# EAGLE design tmod-edison (EAGLE 7.7.0)
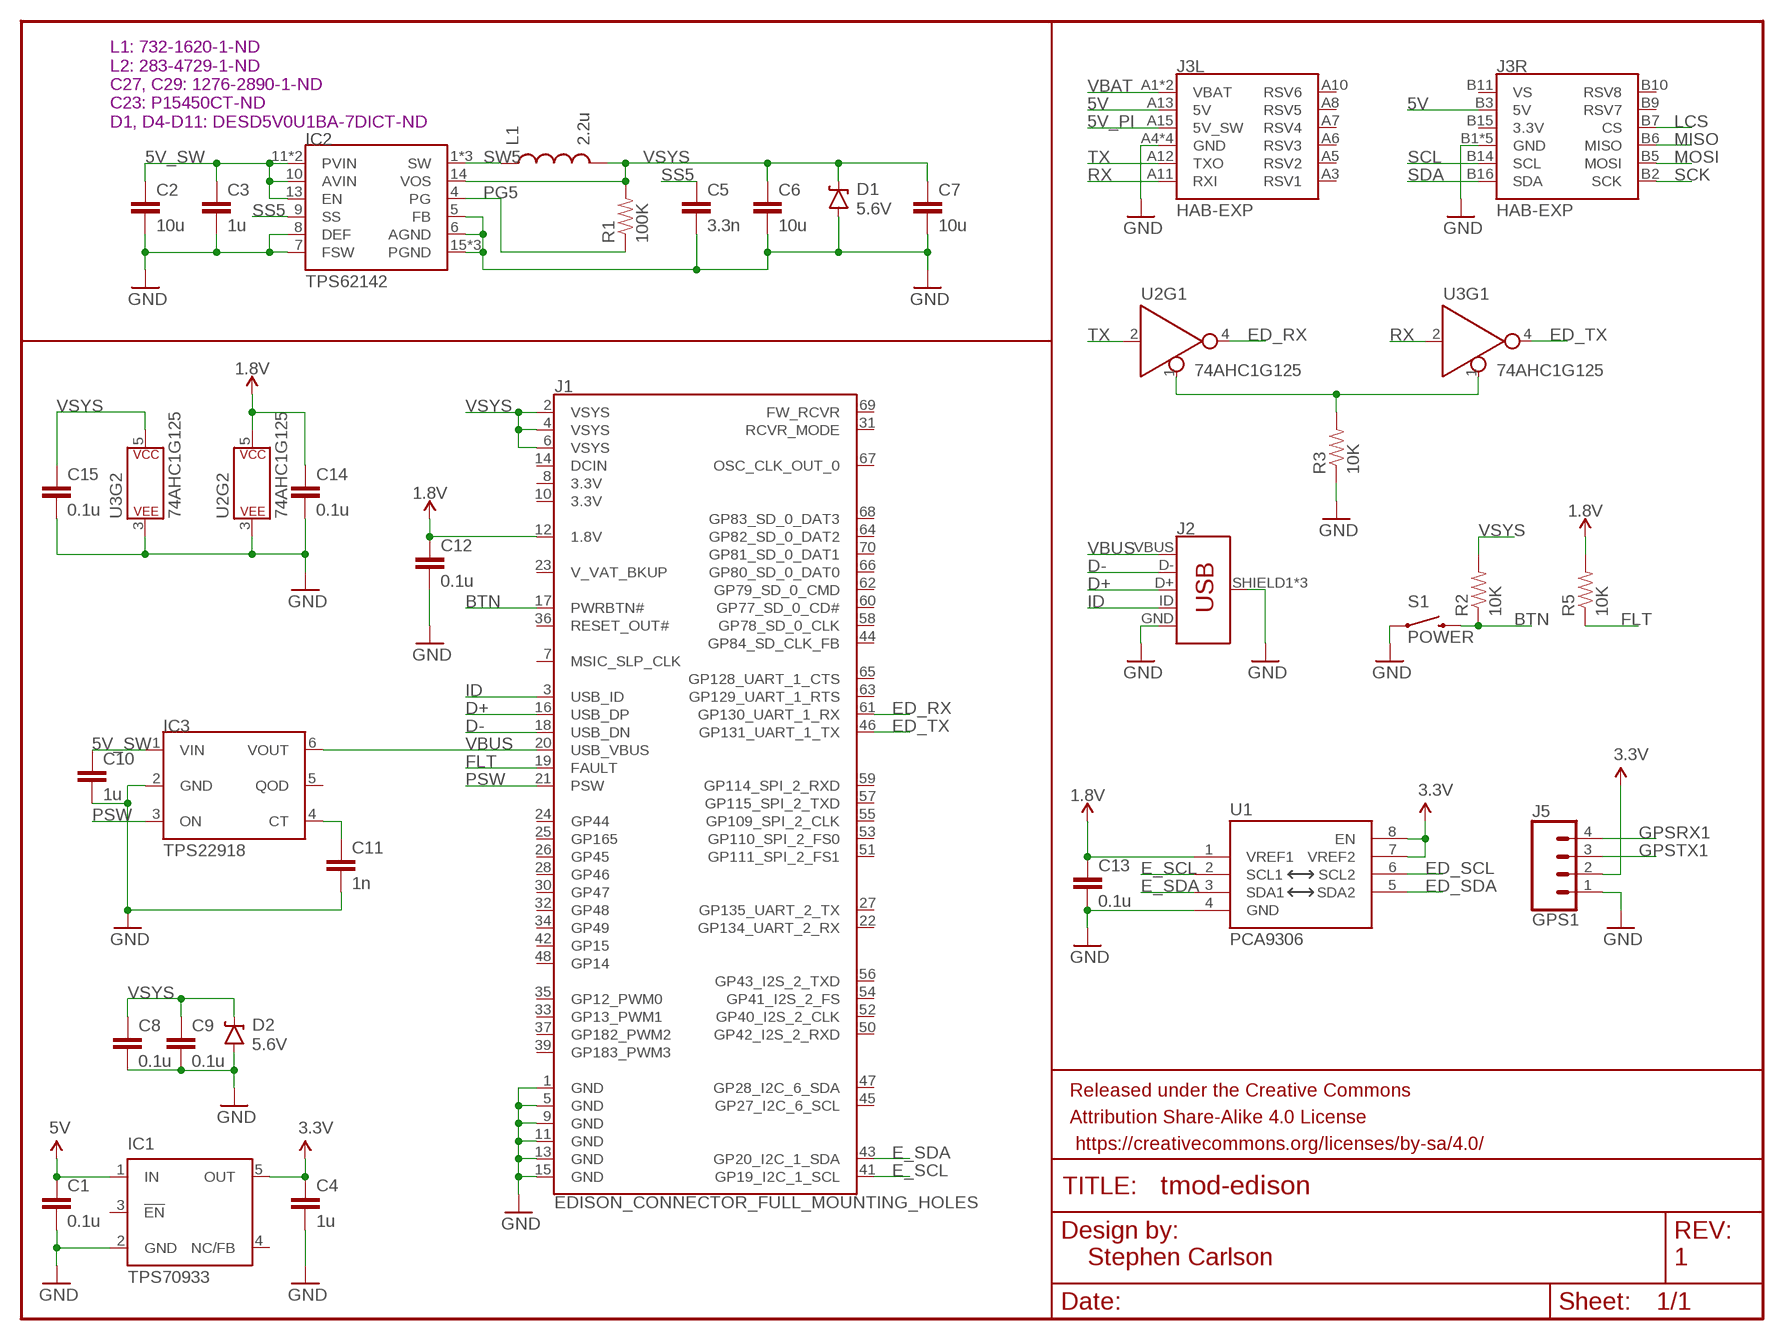
[diagram p0: schematic, sheet 1]

## Parts
C1  0.1u  CAP0805  [0805]
C2  10u  CAP0805  [0805]
C3  1u  CAP0805  [0805]
C4  1u  CAP0805  [0805]
C5  3.3n  CAP0805  [0805]
C6  10u  CAP0805  [0805]
C7  10u  CAP0805  [0805]
C8  0.1u  CAP0805  [0805]
C9  0.1u  CAP0805  [0805]
C10  1u  CAP0805  [0805]
C11  1n  CAP0805  [0805]
C12  0.1u  CAP0805  [0805]
C13  0.1u  CAP0805  [0805]
C14  0.1u  CAP0805  [0805]
C15  0.1u  CAP0805  [0805]
D1  5.6V  DIODE-ZENER5.6V  [SOD-323]
D2  5.6V  DIODE-ZENER5.6V  [SOD-323]
FRAME1  FRAME-LETTERNO_PACKAGE  [DUMMY]
IC1  TPS70933  TPS77033  [SOT23-DBV]
IC2  TPS62142  TPS62140  [QFN16-3X3MM]
IC3  TPS22918  [SOT23-6L]
J1  EDISON_CONNECTOR_FULL_MOUNTING_HOLES  [EDISON_DAUGHTER]
J2  USB_MICRO-B_FEMALE-SMT  [USB-B-MICRO-SMD]
J3  HAB-EXP  [HAB-EXP]
J5  GPS1  CONN_04JST-PTH  [JST-4-PTH]
L1  2.2u  INDUCTORMPIA4012V2  [MPIA4012V2]
R1  100K  RESISTOR0805-RES  [0805]
R2  10K  RESISTOR0805-RES  [0805]
R3  10K  RESISTOR0805-RES  [0805]
R5  10K  RESISTOR0805-RES  [0805]
S1  POWER  SWITCH  [TACTILE-PTH-THIN]
U1  PCA9306  PCA9306PCA9306DC-1:1  [PCA9306DC]
U2  74AHC1G125  74AHC1G125D  [SOT23-5]
U3  74AHC1G125  74AHC1G125D  [SOT23-5]

## Nets
1.8V: C12.1 C13.1 C14.1 J1.12(1.8V) R5.2 U1.1(VREF1) U2.5(P$V+)
3.3V: C4.1 IC1.5(OUT) J5.2 U1.7(VREF2) U1.8(EN)
5V: C1.1 IC1.1(IN) J3.A13(L:5V) J3.B3(R:5V)
5V_PI: J3.A15(L:5V_SW)
5V_SW: C2.1 C3.1 C10.1 IC2.10(AVIN) IC2.11(PVIN) IC2.12(PVIN) IC2.13(EN) IC3.1(VIN)
BTN: J1.17(PWRBTN#) R2.1 S1.2
CT: C11.1 IC3.4(CT)
D+: J1.16(USB_DP) J2.D+
D-: J1.18(USB_DN) J2.D-
E_SCL: J1.41(GP19_I2C_1_SCL) U1.2(SCL1)
E_SDA: J1.43(GP20_I2C_1_SDA) U1.3(SDA1)
ED_RX: J1.61(GP130_UART_1_RX) U2.4(Y)
ED_SCL: U1.6(SCL2)
ED_SDA: U1.5(SDA2)
ED_TX: J1.46(GP131_UART_1_TX) U3.4(Y)
FLT: J1.19(FAULT) R5.1
GND: C1.2 C2.2 C3.2 C4.2 C5.2 C6.2 C7.2 C8.2 C9.2 C10.2 C11.2 C12.2 C13.2 C14.2 C15.2 D1.A D2.A IC1.2(GND) IC2.5(FB) IC2.6(AGND) IC2.7(FSW) IC2.8(DEF) IC2.15(PGND) IC2.16(PGND) IC2.EXT(PGND) IC3.2(GND) J1.1(GND) J1.5(GND) J1.9(GND) J1.11(GND) J1.13(GND) J1.15(GND) J2.GND J2.SHIELD1(SHIELD) J2.SHIELD2(SHIELD) J2.SHIELD3(SHIELD) J3.A4(L:GND) J3.A9(L:GND) J3.A14(L:GND) J3.A16(L:GND) J3.B1(R:GND) J3.B4(R:GND) J3.B8(R:GND) J3.B12(R:GND) J3.B13(R:GND) J5.1 R3.1 S1.1 U1.4(GND) U2.3(P$V-) U3.3(P$V-)
GPSRX1: J5.4
GPSTX1: J5.3
ID: J1.3(USB_ID) J2.ID
LCS: J3.B7(R:CS)
MISO: J3.B6(R:MISO)
MOSI: J3.B5(R:MOSI)
PG5: IC2.4(PG) R1.1
PSW: IC3.3(ON) J1.21(PSW)
RX: J3.A11(L:RXI) U3.2(A)
SCK: J3.B2(R:SCK)
SCL: J3.B14(R:SCL)
SDA: J3.B16(R:SDA)
SS5: C5.1 IC2.9(SS)
SW5: IC2.1(SW) IC2.2(SW) IC2.3(SW) L1.1
TX: J3.A12(L:TXO) U2.2(A)
UART_EN: R3.2 U2.1(!EN) U3.1(!EN)
VBAT: J3.A1(L:VBAT) J3.A2(L:VBAT)
VBUS: IC3.6(VOUT) J1.20(USB_VBUS) J2.VBUS
VSYS: C6.1 C7.1 C8.1 C9.1 C15.1 D1.C D2.C IC2.14(VOS) J1.2(VSYS) J1.4(VSYS) J1.6(VSYS) L1.2 R1.2 R2.2 U3.5(P$V+)
Unconnected: IC1.3(!EN) IC1.4(NC/FB) IC3.5(QOD) J1.7(MSIC_SLP_CLK) J1.8(3.3V) J1.10(3.3V) J1.14(DCIN) J1.22(GP134_UART_2_RX) J1.23(V_VAT_BKUP) J1.24(GP44) J1.25(GP165) J1.26(GP45) J1.27(GP135_UART_2_TX) J1.28(GP46) J1.30(GP47) J1.31(RCVR_MODE) J1.32(GP48) J1.33(GP13_PWM1) J1.34(GP49) J1.35(GP12_PWM0) J1.36(RESET_OUT#) J1.37(GP182_PWM2) J1.39(GP183_PWM3) J1.42(GP15) J1.44(GP84_SD_CLK_FB) J1.45(GP27_I2C_6_SCL) J1.47(GP28_I2C_6_SDA) J1.48(GP14) J1.50(GP42_I2S_2_RXD) J1.51(GP111_SPI_2_FS1) J1.52(GP40_I2S_2_CLK) J1.53(GP110_SPI_2_FS0) J1.54(GP41_I2S_2_FS) J1.55(GP109_SPI_2_CLK) J1.56(GP43_I2S_2_TXD) J1.57(GP115_SPI_2_TXD) J1.58(GP78_SD_0_CLK) J1.59(GP114_SPI_2_RXD) J1.60(GP77_SD_0_CD#) J1.62(GP79_SD_0_CMD) J1.63(GP129_UART_1_RTS) J1.64(GP82_SD_0_DAT2) J1.65(GP128_UART_1_CTS) J1.66(GP80_SD_0_DAT0) J1.67(OSC_CLK_OUT_0) J1.68(GP83_SD_0_DAT3) J1.69(FW_RCVR) J1.70(GP81_SD_0_DAT1) J3.A3(L:RSV1) J3.A5(L:RSV2) J3.A6(L:RSV3) J3.A7(L:RSV4) J3.A8(L:RSV5) J3.A10(L:RSV6) J3.B9(R:RSV7) J3.B10(R:RSV8)

## Notes on the sheet
- L1: 732-1620-1-ND
  L2: 283-4729-1-ND
  C27, C29: 1276-2890-1-ND
  C23: P15450CT-ND
  D1, D4-D11: DESD5V0U1BA-7DICT-ND
- Stephen Carlson | 1

## Power pins joined to a net without a drawn wire
3.3V: J3.B15(R:3.3V)
VS: J3.B11(R:VS)

## Library data of the parts
C1-C15 = SparkFun-Passives:CAP: Capacitor Standard 0603 ceramic capacitor, and 0.1" leaded capacitor.
D1 D2 = SparkFun-DiscreteSemi:DIODE-ZENER: Zener Diode Production Part - 8199 3.4V Zener Voltage; PROD_ID: DIO-12442
FRAME1 = SparkFun-Aesthetics:FRAME-LETTER: Schematic Frame - Letter Standard 8.5x11 US Letter frame; DESIGNER: Nobody; VERSION: v01
IC1 = texas:TPS770*: ULTRALOW-POWER 50-mA LOW-DROPOUT LINEAR REGULATORS 50-mA Low-Dropout Regulator Source: http://focus.ti.com/lit/ds/symlink/tps77001.pdf; MF: TEXAS INSTRUMENTS; MPN: TPS77033DBVT; OC_FARNELL: 8461570; OC_NEWARK: 77C1187
IC2 = HAB:TPS62140: TPS62140/1/2/3 Adjustable or fixed output switch-mode 2A D-CAP2 regulator
IC3 = HAB:TPS22918: TPS22918 5.5-V, 2-A, 52-mΩOn-Resistance Load Switch
J1 = SparkFun-Connectors:EDISON_CONNECTOR_FULL: Intel ® Edison Hirose Connectors DF40 Series 70 pin connector 3mm headers and sockets used on the SparkFun Edison Blocks. Edison Daughter package includes layout for the Edison module itself, including mounting holes and antenna area marked. SparkFun Products: SparkFun ADC Edison Block <https://www.sparkfun.com/products/13770> SparkFun Power Edison Block <https://www.sparkfun.com/products/13727> SparkFun Base Edison Block <https://www.sparkfun.com/products/13045> SparkFun Dual H-Bridge Edison Block <https://www.sparkfun.com/products/13043> SparkFun microSD Edison Block <https://www.sparkfun.com/products/13041>
J2 = SparkFun-Connectors:USB_MICRO-B: USB Type Micro-B Connector Male/female and PTH/SMT variants SparkFun Products: SparkFun microB USB Breakout <https://www.sparkfun.com/products/12035> SparkFun USB microB Plug Breakout <https://www.sparkfun.com/products/10031> SparkFun ESP8266 Thing <https://www.sparkfun.com/products/13231>; PROD_ID: CONN-11752
J3 = HAB:HAB-EXP: HAB Expansion Connector Dual 2x8 expansion connectors for HAB project
J5 = SparkFun-Connectors:CONN_04: Multi connection point. Often used as Generic Header-pin footprint for 0.1 inch spaced/style header connections On any of the 0.1 inch spaced packages, you can populate with these: Break Away Headers - Straight <https://www.sparkfun.com/products/116> (PRT-00116) Break Away Male Headers - Right Angle <https://www.sparkfun.com/products/553> (PRT-00553) Female Headers <https://www.sparkfun.com/products/115> (PRT-00115) Break Away Headers - Machine Pin <https://www.sparkfun.com/products/117> (PRT-00117) Break Away Female Headers - Swiss Machine Pin <https://www.sparkfun.com/products/743> (PRT-00743) For SCREWTERMINALS and SPRING TERMINALS visit here: Screw Terimnals on SparkFun.com <https://www.sparkfun.com/search/results?term=Screw+Terminals> (5mm/3.5mm/2.54mm spacing) This device is also useful as a general connection point to wire up your design to another part of your project. Our various solder wires solder well into these plated through hole pads. Hook-Up Wire - Assortment (Stranded, 22 AWG) <https://www.sparkfun.com/products/11375> (PRT-11375) Hook-Up Wire - Assortment (Solid Core, 22 AWG) <https://www.sparkfun.com/products/11367> (PRT-11367) View the entire wire category on our website here <https://www.sparkfun.com/categories/141> Special notes: Molex polarized connector foot print use with SKU : PRT-08231 with associated crimp pins and housings. 1MM SMD Version SKU: PRT-10208; PROD_ID: WIRE-13531; SF_ID: PRT-09916
L1 = HAB:INDUCTOR: INDUCTOR Standard inductor, with some new packages Why do inductors never come in standard packages!?
R1-R3 R5 = SparkFun-Passives:RESISTOR: Resistor Basic schematic elements and footprints for 0603, 1206, and PTH resistors.
S1 = HAB:SWITCH: SWITCH Package for the MJTP1250, a thinner and lighter PTH push button switch.
U1 = SparkFun-IC-Comms:PCA9306: Bidirectional I2C level shifter Not compatible with all available part number pinout schemes- DOUBLE CHECK!!! Datasheet <https://cdn.sparkfun.com/datasheets/BreakoutBoards/PCA9306DC.pdf> SparkFun Products SparkFun Inventor's Kit for RedBot <https://www.sparkfun.com/products/12649> (ROB-12649) SparkFun RedBot Basic Kit <https://www.sparkfun.com/products/13166> (ROB-13166) SparkFun Level Translator Breakout - PCA9306 <https://www.sparkfun.com/products/11955> (BOB-11955) SparkFun Block for Intel Edison - ADC <https://www.sparkfun.com/products/13770> (DEV-13770) SparkFun Block for Intel® Edison - Raspberry Pi B <https://www.sparkfun.com/products/13044> (DEV-13044) SparkFun RedBot Sensor - Accelerometer <https://www.sparkfun.com/products/12589> (SEN-12589); PROD_ID: IC-10023
U2 U3 = SparkFun-IC-Logic:74*1G125: Single buffer Buffers & Line Drivers Tri-State Single Bus SOT-23-5 Datasheet SparkFun Products SparkFun SAMD21 Mini Breakout <https://www.sparkfun.com/products/13664> (DEV-13664) SparkFun SAMD21 Dev Breakout <https://www.sparkfun.com/products/13672> (DEV-13672) SparkFun MIDI Shield <https://www.sparkfun.com/products/12898> (DEV-12898) SparkFun WiFi Shield - CC3000 <https://www.sparkfun.com/products/12071> (DEV-12071); PROD_ID: IC-11920; VALUE: SN74AHC1G125

## Board
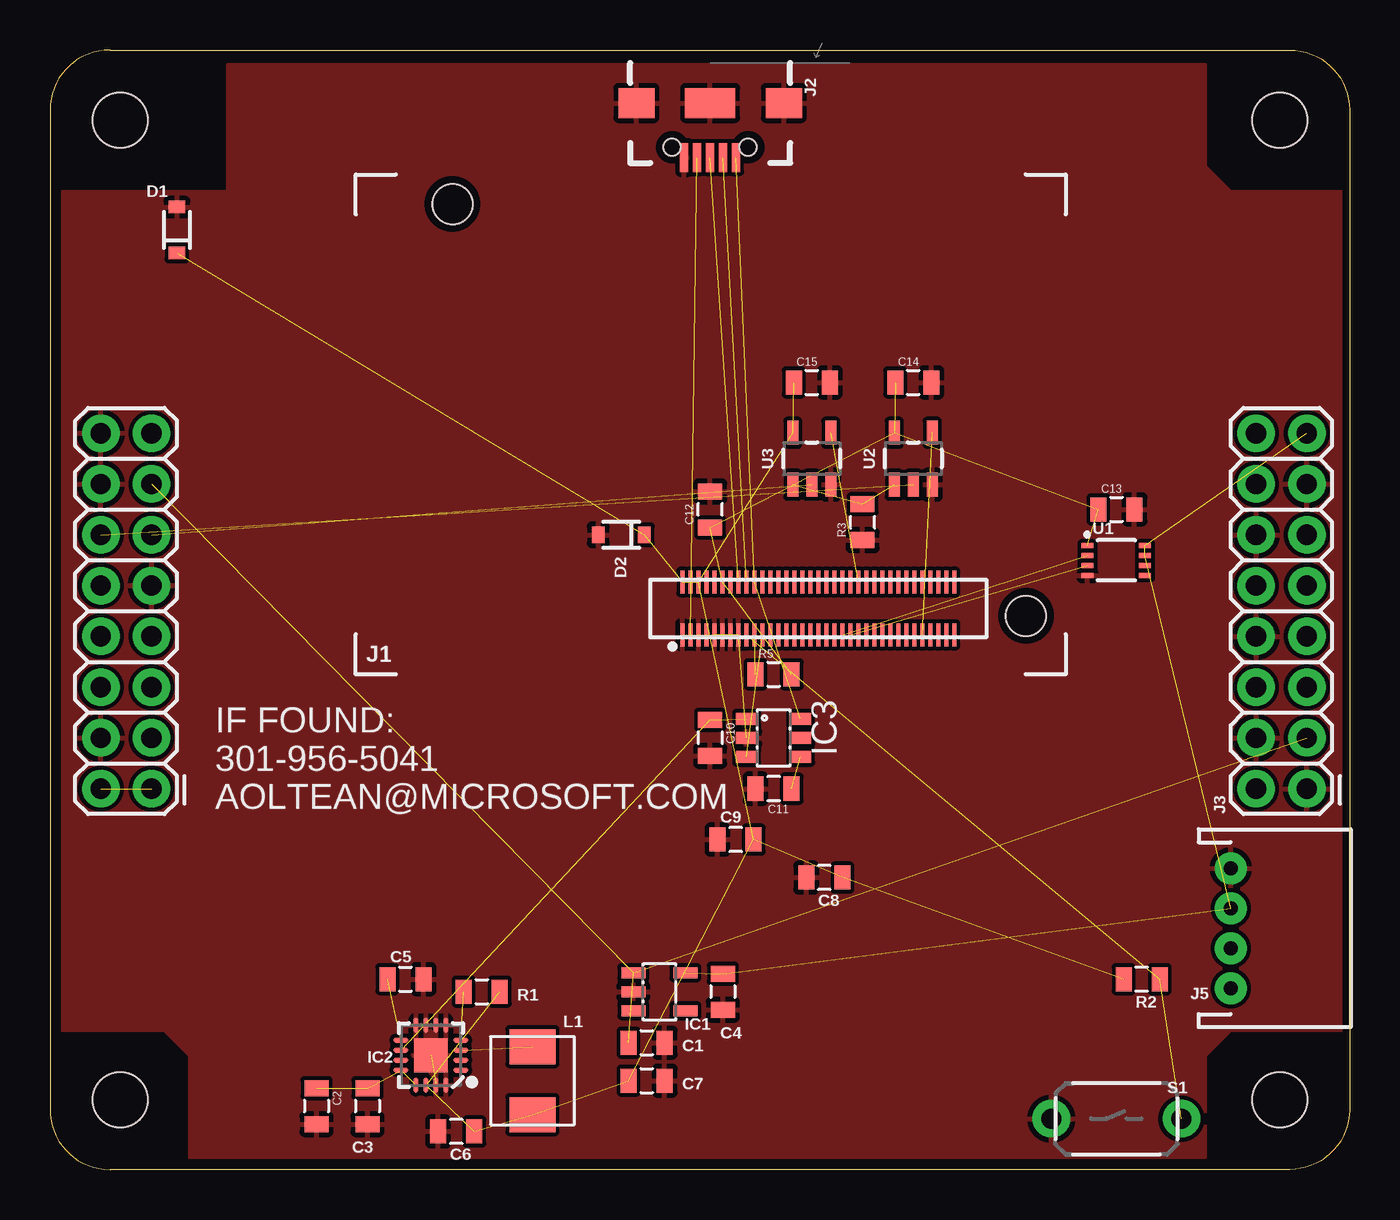
[diagram p1: board, top side]
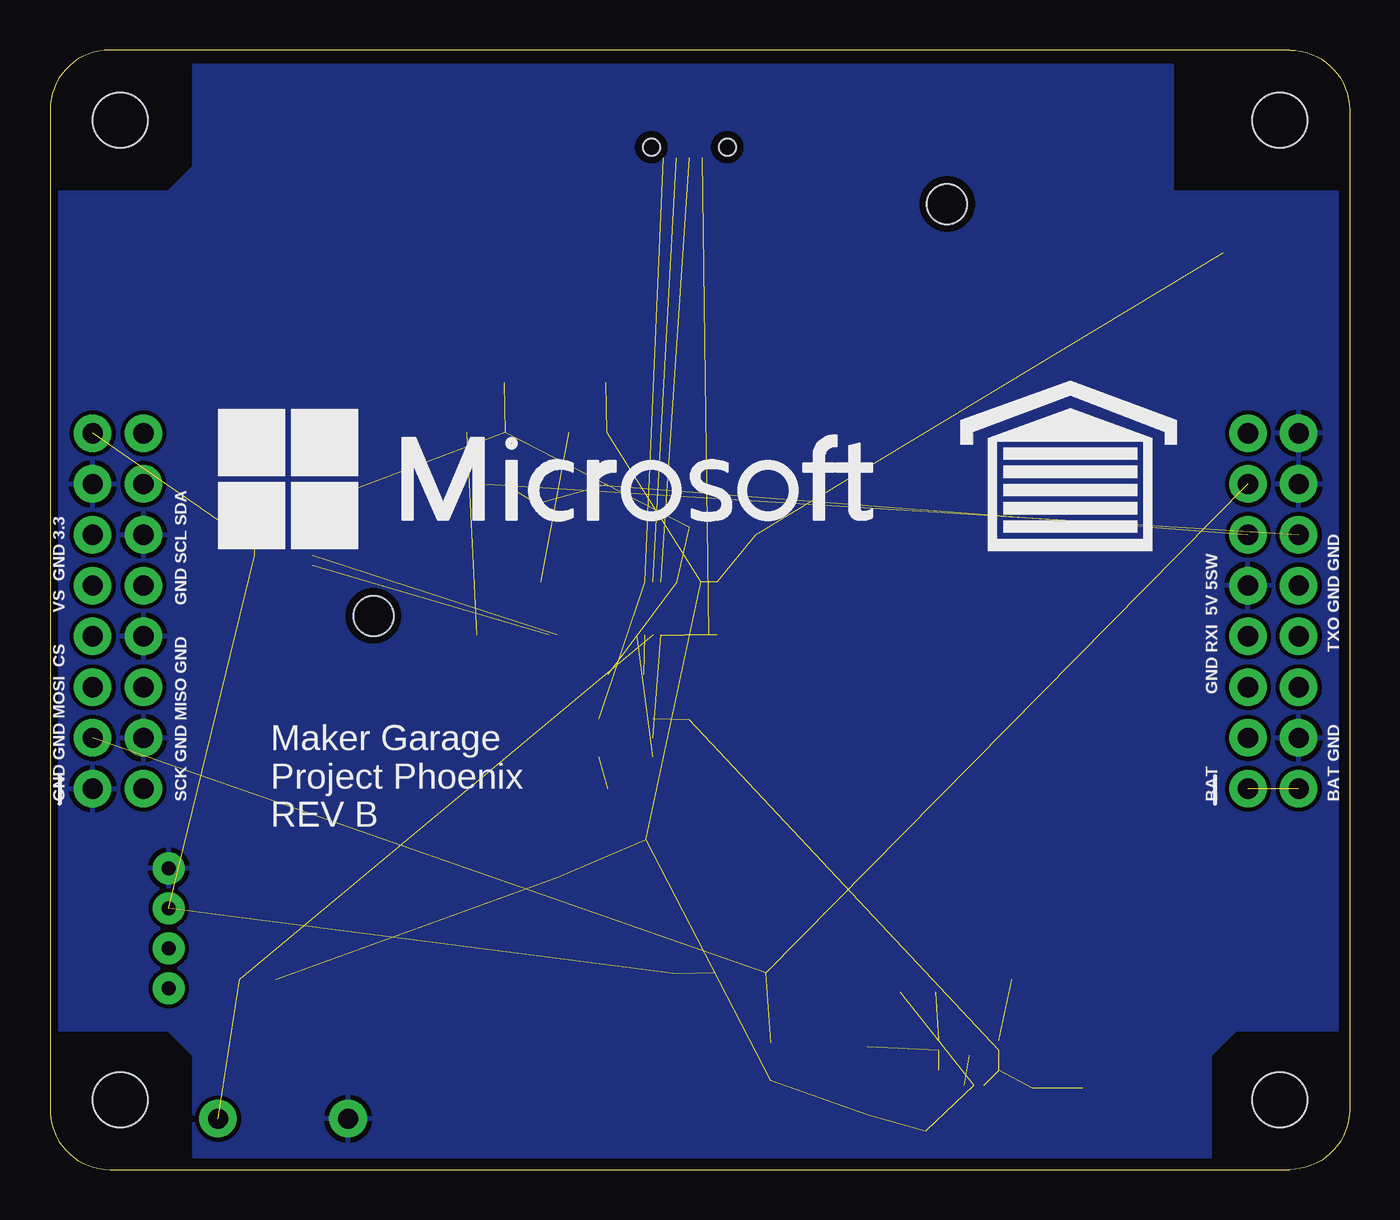
[diagram p2: board, bottom side, seen from below]

Size 65 x 56 mm. Coordinates in mm from the lower left corner, seen from the top.
Outline: 0,53 0,3 arc90 3,0 62,0 arc90 65,3 65,53 arc90 62,56 3,56 arc90 0,53
Copper layers (1*16): Top 0.035559375mm / dielectric 1.6mm / Bottom 0.035559375mm
Design rules "oshpark-2layer *": minimum track width 6mil, minimum drill 10mil, track to track 6mil, track to pad 6mil, pad to pad 6mil, via to via 6mil, smd to smd 6mil, copper to edge 15mil, drill to drill 6mil, minimum pad ring 5mil, minimum via ring 5mil, stop-mask expansion 2.5mil, vias tented up to drill 0mil, thermal gap 10mil
Holes 2.75 mm at 3.5,52.5 61.5,3.5 3.5,3.5 61.5,52.5
tKeepout: area 0.5,49.5 to 6.5,55.5; area 0.5,0.5 to 6.5,6.5; area 58.5,0.5 to 64.5,6.5; area 58.5,49.5 to 64.5,55.5

### Footprints (pad centres in the part's own frame; a part is rotated, then mirrored left to right if it is on the bottom)
0805 = smd 0.8 x 1.2: 1 -0.9,0; 2 0.9,0
SOD-323 = smd 0.63 x 0.83: A 1.15,0; C -1.15,0
SOT23-DBV = smd 0.55 x 1.2: 1 -0.95,-1.3; 2 0,-1.3; 3 0.95,-1.3; 4 0.95,1.3; 5 -0.95,1.3
QFN16-3X3MM = smd 0.75 x 0.25: 1 -1.5,0.75; 2 -1.5,0.25; 3 -1.5,-0.25; 4 -1.5,-0.75; 9 1.5,-0.75; 10 1.5,-0.25; 11 1.5,0.25; 12 1.5,0.75 | smd 0.25 x 0.75: 5 -0.75,-1.5; 6 -0.25,-1.5; 7 0.25,-1.5; 8 0.75,-1.5; 13 0.75,1.5; 14 0.25,1.5; 15 -0.25,1.5; 16 -0.75,1.5 | smd 1.68 x 1.68: EXT 0,0
SOT23-6L = smd 0.6 x 1.05: 1 -0.95,-1.35; 2 0,-1.35; 3 0.95,-1.35; 4 0.95,1.35; 5 0,1.35; 6 -0.95,1.35
EDISON_DAUGHTER = smd 1.14 x 0.2: 1 1.98,19.17; 2 4.62,19.17; 3 1.98,18.77; 4 4.62,18.77; 5 1.98,18.37; 6 4.62,18.37; 7 1.98,17.97; 8 4.62,17.97; 9 1.98,17.57; 10 4.62,17.57; 11 1.98,17.17; 12 4.62,17.17; 13 1.98,16.77; 14 4.62,16.77; 15 1.98,16.37; 16 4.62,16.37; 17 1.98,15.97; 18 4.62,15.97; 19 1.98,15.57; 20 4.62,15.57; 21 1.98,15.17; 22 4.62,15.17; 23 1.98,14.77; 24 4.62,14.77; 25 1.98,14.37; 26 4.62,14.37; 27 1.98,13.97; 28 4.62,13.97; 29 1.98,13.57; 30 4.62,13.57; 31 1.98,13.17; 32 4.62,13.17; 33 1.98,12.77; 34 4.62,12.77; 35 1.98,12.37; 36 4.62,12.37; 37 1.98,11.97; 38 4.62,11.97; 39 1.98,11.57; 40 4.62,11.57; 41 1.98,11.17; 42 4.62,11.17; 43 1.98,10.77; 44 4.62,10.77; 45 1.98,10.37; 46 4.62,10.37; 47 1.98,9.97; 48 4.62,9.97; 49 1.98,9.57; 50 4.62,9.57; 51 1.98,9.17; 52 4.62,9.17; 53 1.98,8.77; 54 4.62,8.77; 55 1.98,8.37; 56 4.62,8.37; 57 1.98,7.97; 58 4.62,7.97; 59 1.98,7.57; 60 4.62,7.57; 61 1.98,7.17; 62 4.62,7.17; 63 1.98,6.77; 64 4.62,6.77; 65 1.98,6.37; 66 4.62,6.37; 67 1.98,5.97; 68 4.62,5.97; 69 1.98,5.57; 70 4.62,5.57 | hole 2: 23.53,30.67; 2.93,1.98
USB-B-MICRO-SMD = smd 1.45 x 0.4: D+ 2.725,0; D- 2.725,0.65; GND 2.725,-1.3; ID 2.725,-0.65; VBUS 2.725,1.3 | smd 1.5 x 1.8: SHIELD1 0,3.685; SHIELD2 0,-3.685 | smd 1.5 x 2.5: SHIELD3 0,0 | hole 0.85: 2.2,1.9; 2.2,-1.9
HAB-EXP = drill 1.016 pad 1.88: A1 17.78,2.54; A2 17.78,0; A3 15.24,2.54; A4 15.24,0; A5 12.7,2.54; A6 12.7,0; A7 10.16,2.54; A8 10.16,0; A9 7.62,2.54; A10 7.62,0; A11 5.08,2.54; A12 5.08,0; A13 2.54,2.54; A14 2.54,0; A15 0,2.54; A16 0,0; B1 17.78,60.325; B2 17.78,57.785; B3 15.24,60.325; B4 15.24,57.785; B5 12.7,60.325; B6 12.7,57.785; B7 10.16,60.325; B8 10.16,57.785; B9 7.62,60.325; B10 7.62,57.785; B11 5.08,60.325; B12 5.08,57.785; B13 2.54,60.325; B14 2.54,57.785; B15 0,60.325; B16 0,57.785
JST-4-PTH = drill 0.7 pad 1.6: 1 -3,0; 2 -1,0; 3 1,0; 4 3,0
MPIA4012V2 = smd 2.3 x 1.75: 1 0,1.7; 2 0,-1.7
TACTILE-PTH-THIN = drill 1.016 pad 1.88: 1 -3.251,0; 2 3.251,0
PCA9306DC = smd 0.25 x 0.602: 1 -0.73,-1.446; 2 -0.23,-1.446; 3 0.27,-1.446; 4 0.77,-1.446; 5 0.77,1.431; 6 0.27,1.431; 7 -0.23,1.431; 8 -0.73,1.431
SOT23-5 = smd 0.55 x 1.2: 1 -0.95,-1.3; 2 0,-1.3; 3 0.95,-1.3; 4 0.95,1.3; 5 -0.95,1.3

### Placement (x,y rotation side)
C1  29.84,6.35 0 top
C2  13.34,3.17 270 top
C3  15.88,3.17 270 top
C4  33.66,8.89 270 top
C5  17.78,9.53 0 top
C6  20.32,1.91 180 top
C7  29.84,4.45 0 top
C8  38.73,14.61 180 top
C9  34.29,16.51 180 top
C10  33.02,21.59 270 top
C11  36.2,19.05 180 top
C12  33.02,33.02 90 top
C13  53.34,33.02 0 top
C14  43.18,39.37 0 top
C15  38.1,39.37 0 top
D1  6.35,46.99 90 top
D2  28.57,31.75 180 top
FRAME1  0,57.15 0 top
IC1  30.48,8.89 270 top
IC2  19.05,5.71 180 top
IC3  36.2,21.59 270 top
J1  50.8,24.77 90 top
J2  33.02,53.34 270 top
J3  2.54,36.83 270 top
J5  59.05,12.06 270 top
L1  24.13,4.45 0 top
R1  21.59,8.89 0 top
R2  54.61,9.53 180 top
R3  40.64,32.38 90 top
R5  36.2,24.77 0 top
S1  53.34,2.54 0 top
U1  53.34,30.48 270 top
U2  43.18,35.56 0 top
U3  38.1,35.56 0 top
U$1  [MSFT_LOGO]  37.47,34.29 0 bottom
U$2  [GARAGE]  13.97,34.29 0 bottom

### Tracks (layer width: path | path; a pad name or v marks a point on that pad's centre or on a via)
1.8V  (6 unrouted)
3.3V  (5 unrouted)
5V  (3 unrouted)
5V_SW  (7 unrouted)
BTN  (2 unrouted)
CT  (1 unrouted)
D+  (1 unrouted)
D-  (1 unrouted)
E_SCL  (1 unrouted)
E_SDA  (1 unrouted)
ED_RX  (1 unrouted)
ED_TX  (1 unrouted)
FLT  (1 unrouted)
GND  (7 unrouted)
  pour Top (isolate 0.203, rank 4): 0.64,48.9 0.64,6.99 5.71,6.99 6.99,5.71 6.99,0.64 57.78,0.64 57.78,5.71 59.05,6.99 64.77,6.99 64.77,48.9 59.05,48.9 57.78,50.16 57.78,55.24 8.89,55.24 8.89,48.9
  pour Bottom (isolate 0.203, rank 4): 0.64,48.9 0.64,6.99 5.71,6.99 6.99,5.71 6.99,0.64 57.78,0.64 57.78,5.71 59.05,6.99 64.77,6.99 64.77,48.9 59.05,48.9 57.78,50.16 57.78,55.24 8.89,55.24 8.89,48.9
ID  (1 unrouted)
PG5  (1 unrouted)
PSW  (1 unrouted)
RX  (1 unrouted)
SS5  (1 unrouted)
SW5  (3 unrouted)
TX  (1 unrouted)
UART_EN  (2 unrouted)
VBAT  (1 unrouted)
VBUS  (2 unrouted)
VSYS  (14 unrouted)

### Text on the board
tPlace: IF FOUND: / 301-956-5041 / AOLTEAN@MICROSOFT.COM
bPlace: BAT GND TXO GND GND | BAT GND RXI 5V 5SW | SCK GND MISO GND GND SCL SDA | GND GND MOSI CS VS GND 3.3 | Maker Garage / Project Phoenix / REV B